# Altium schematic sheet 18_HD4_PUMP_2.SchDoc
size 420 x 297 mm; SheetNumber: 29; SheetTotal: 33
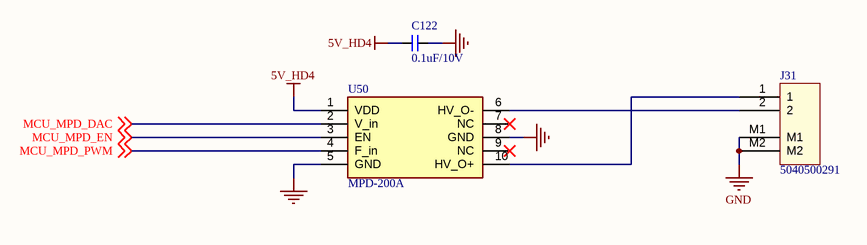
[diagram p0: 18_HD4_PUMP_2.SchDoc]

## Parts
C122  0.1uF/10V  [CAP_C_1005X50_L]
J31  5040500291  [MOLEX_5040500291]
U50  MPD-200A  [MPD-200a]

## Nets
5V_HD4: C122.2 U50.1(VDD)
GND: C122.1 J31.M1 J31.M2 U50.5(GND) U50.8(GND)
MCU_MPD_DAC: U50.2(V_in) ; off-sheet MCU_MPD_DAC
MCU_MPD_EN: U50.3(EN) ; off-sheet MCU_MPD_EN
MCU_MPD_PWM: U50.4(F_in) ; off-sheet MCU_MPD_PWM
NetJ31_1: J31.1 U50.10(HV_O+)
NetJ31_2: J31.2 U50.6(HV_O-)

Not connected (* = marked no-connect by the designer): U50 7(NC)* 9(NC)*

## Notes on the sheet
- Project:
- BEE-1012
- Sub-system:
- SATELLITE_EXP_CONTROLLER
- Design by:
- SANG HUYNH
- BAO BUI
- Sheet title:
- Sheet
- A3
- of
- Checked by:
- Approved by:
- VU PHAM
- Revision:
- Document No:
- Size:
- Date:

## Library data of the parts
C122 = _CAP_C_2: CAP
J31 = Header 2x1_2M